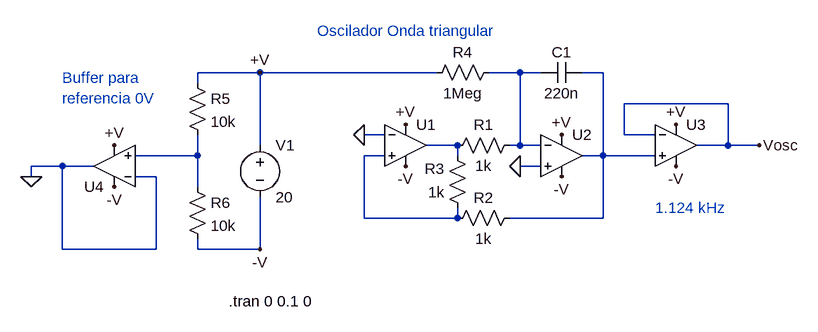
[diagram p0: schematic Oscilador_para_pwm_motor.asc]
Oscilador_para_pwm_motor.asc, the LTspice schematic file:
Version 4
SHEET 1 880 680
WIRE -144 32 -240 32
WIRE 128 32 -144 32
WIRE 256 32 208 32
WIRE 288 32 256 32
WIRE 384 32 352 32
WIRE -240 48 -240 32
WIRE 576 80 416 80
WIRE 48 128 16 128
WIRE 416 128 416 80
WIRE 464 128 416 128
WIRE -144 144 -144 32
WIRE 160 144 112 144
WIRE 256 144 256 32
WIRE 256 144 240 144
WIRE 288 144 256 144
WIRE 576 144 576 80
WIRE 576 144 528 144
WIRE 624 144 576 144
WIRE -240 160 -240 128
WIRE -240 160 -336 160
WIRE 48 160 16 160
WIRE 160 160 160 144
WIRE 384 160 384 32
WIRE 384 160 352 160
WIRE 464 160 384 160
WIRE -448 176 -496 176
WIRE -400 176 -448 176
WIRE 288 176 256 176
WIRE -496 192 -496 176
WIRE -304 192 -336 192
WIRE -240 208 -240 160
WIRE 16 256 16 160
WIRE 160 256 160 240
WIRE 160 256 16 256
WIRE 384 256 384 160
WIRE 384 256 240 256
WIRE -448 304 -448 176
WIRE -304 304 -304 192
WIRE -304 304 -448 304
WIRE -240 304 -240 288
WIRE -144 304 -144 224
WIRE -144 304 -240 304
FLAG 256 176 0
FLAG -144 304 -V
FLAG 80 176 -V
FLAG 320 192 -V
FLAG 320 128 +V
FLAG 80 112 +V
FLAG -144 32 +V
FLAG 16 128 0
FLAG 624 144 Vosc
FLAG 496 176 -V
FLAG 496 112 +V
FLAG -496 192 0
FLAG -368 208 -V
FLAG -368 144 +V
SYMBOL OpAmps\\UniversalOpAmp2 80 144 R0
SYMATTR InstName U1
SYMBOL OpAmps\\UniversalOpAmp2 320 160 R0
SYMATTR InstName U2
SYMBOL res 256 128 R90
WINDOW 0 0 56 VBottom 2
WINDOW 3 32 56 VTop 2
SYMATTR InstName R1
SYMATTR Value 1k
SYMBOL res 256 240 R90
WINDOW 0 0 56 VBottom 2
WINDOW 3 32 56 VTop 2
SYMATTR InstName R2
SYMATTR Value 1k
SYMBOL res 176 256 R180
WINDOW 0 36 76 Left 2
WINDOW 3 36 40 Left 2
SYMATTR InstName R3
SYMATTR Value 1k
SYMBOL cap 352 16 R90
WINDOW 0 0 32 VBottom 2
WINDOW 3 32 32 VTop 2
SYMATTR InstName C1
SYMATTR Value 220n
SYMBOL res 224 16 R90
WINDOW 0 0 56 VBottom 2
WINDOW 3 32 56 VTop 2
SYMATTR InstName R4
SYMATTR Value 1Meg
SYMBOL OpAmps\\UniversalOpAmp2 496 144 R0
SYMATTR InstName U3
SYMBOL OpAmps\\UniversalOpAmp2 -368 176 R180
SYMATTR InstName U4
SYMBOL res -256 32 R0
SYMATTR InstName R5
SYMATTR Value 10k
SYMBOL res -256 192 R0
SYMATTR InstName R6
SYMATTR Value 10k
SYMBOL voltage -144 128 R0
WINDOW 123 0 0 Left 0
WINDOW 39 0 0 Left 0
SYMATTR InstName V1
SYMATTR Value 20
TEXT -192 384 Left 2 !.tran 0 0.1 0
TEXT 464 240 Left 2 ;1.124 kHz
TEXT -448 40 Left 2 ;Buffer para \nreferencia 0V
TEXT -56 -32 Left 2 ;Oscilador Onda triangular

The netlist it stands for:
* Oscilador_para_pwm_motor.asc
XU1 N005 0 +V -V N003 level2 Avol=1Meg GBW=10Meg Slew=10Meg Ilimit=25m Rail=0 Vos=0 En=0 Enk=0 In=0 Ink=0 Rin=500Meg  ; pins In+ In- V+ V- OUT
XU2 0 N001 +V -V N002 level2 Avol=1Meg GBW=10Meg Slew=10Meg Ilimit=25m Rail=0 Vos=0 En=0 Enk=0 In=0 Ink=0 Rin=500Meg  ; pins In+ In- V+ V- OUT
R1 N001 N003 1k
R2 N002 N005 1k
R3 N005 N003 1k
C1 N002 N001 220n
R4 N001 +V 1Meg
XU3 N002 Vosc +V -V Vosc level2 Avol=1Meg GBW=10Meg Slew=10Meg Ilimit=25m Rail=0 Vos=0 En=0 Enk=0 In=0 Ink=0 Rin=500Meg  ; pins In+ In- V+ V- OUT
XU4 N004 0 -V +V 0 level2 Avol=1Meg GBW=10Meg Slew=10Meg Ilimit=25m Rail=0 Vos=0 En=0 Enk=0 In=0 Ink=0 Rin=500Meg  ; pins In+ In- V+ V- OUT
R5 +V N004 10k
R6 N004 -V 10k
V1 +V -V 20
.tran 0 0.1 0
* 1.124 kHz
* Buffer para
* referencia 0V
* Oscilador Onda triangular
.lib UniversalOpAmp2.lib
.backanno
.end